# Altium schematic sheet LTC6803.SchDoc
size A
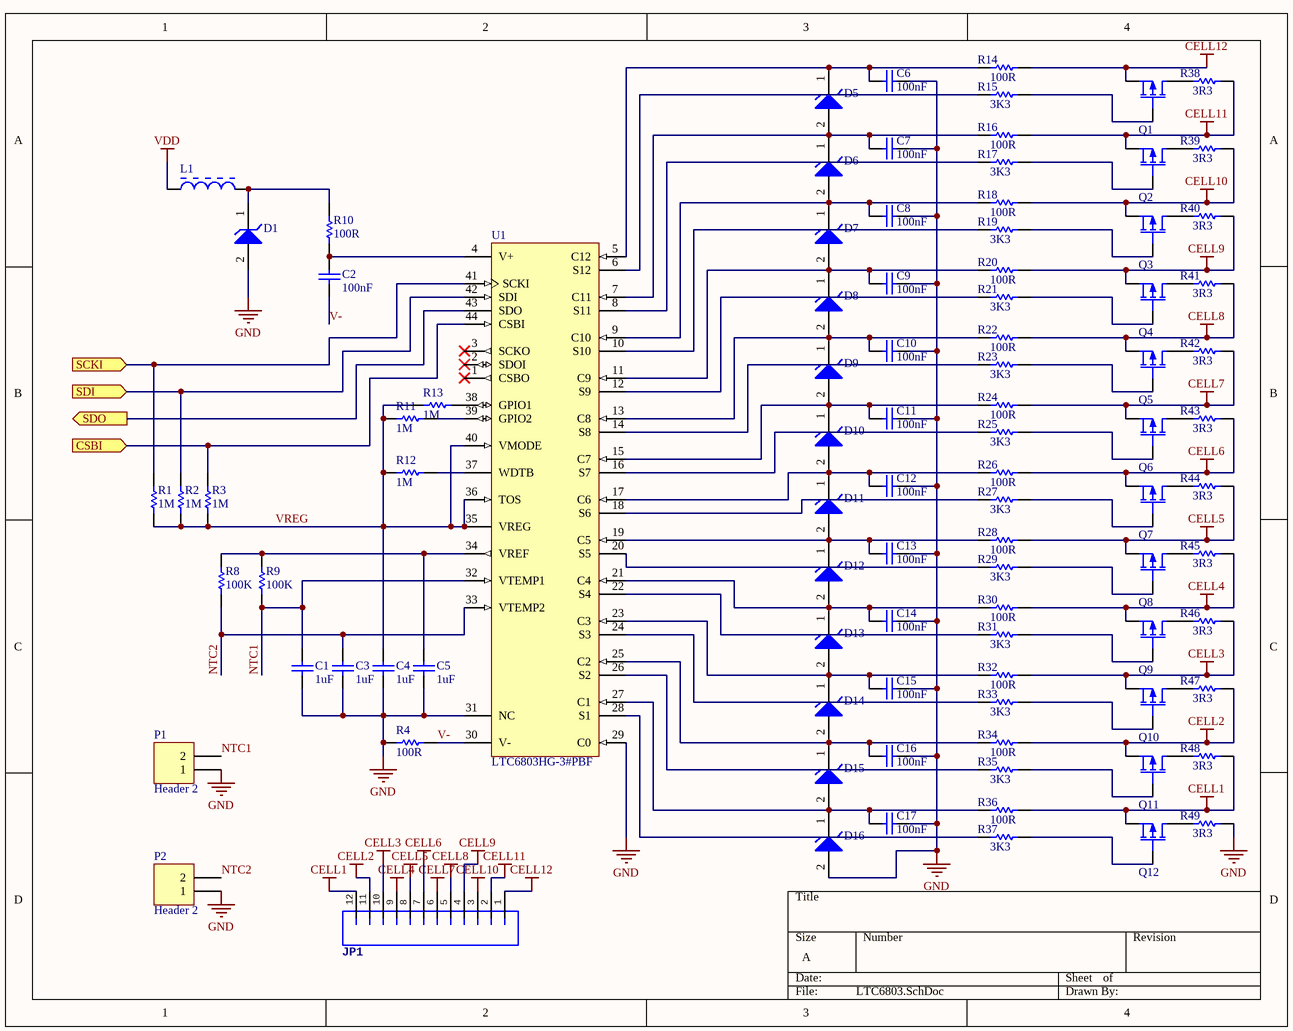
[diagram p0: LTC6803.SchDoc]

## Parts
C1  1uF  [CAPC0603(1608)100_N]
C2  100nF  [CAPC0603(1608)100_L]
C3  1uF  [CAPC0603(1608)100_N]
C4  1uF  [CAPC0603(1608)100_N]
C5  1uF  [CAPC0603(1608)100_N]
C6  100nF  [CAPC0603(1608)100_M]
C7  100nF  [CAPC0603(1608)100_M]
C8  100nF  [CAPC0603(1608)100_M]
C9  100nF  [CAPC0603(1608)100_M]
C10  100nF  [CAPC0603(1608)100_M]
C11  100nF  [CAPC0603(1608)100_M]
C12  100nF  [CAPC0603(1608)100_M]
C13  100nF  [CAPC0603(1608)100_M]
C14  100nF  [CAPC0603(1608)100_M]
C15  100nF  [CAPC0603(1608)100_M]
C16  100nF  [CAPC0603(1608)100_M]
C17  100nF  [CAPC0603(1608)100_M]
D1  (no value)  [SOD-123]
D5  (no value)  [ONSC-SOD-323-2-477-02_V]
D6  (no value)  [ONSC-SOD-323-2-477-02_V]
D7  (no value)  [ONSC-SOD-323-2-477-02_V]
D8  (no value)  [ONSC-SOD-323-2-477-02_V]
D9  (no value)  [ONSC-SOD-323-2-477-02_V]
D10  (no value)  [ONSC-SOD-323-2-477-02_V]
D11  (no value)  [ONSC-SOD-323-2-477-02_V]
D12  (no value)  [ONSC-SOD-323-2-477-02_V]
D13  (no value)  [ONSC-SOD-323-2-477-02_V]
D14  (no value)  [ONSC-SOD-323-2-477-02_V]
D15  (no value)  [ONSC-SOD-323-2-477-02_V]
D16  (no value)  [ONSC-SOD-323-2-477-02_V]
JP1  (no value)  [JST-6-PTH-VERT]
L1  (no value)  [MURA-BLM31-B60-CHIP-2_V3]
P1  Header 2  [HDR1X2]
P2  Header 2  [HDR1X2]
Q1  MOSFET-P  [SOT23-3]  (value not drawn)
Q2  MOSFET-P  [SOT23-3]  (value not drawn)
Q3  MOSFET-P  [SOT23-3]  (value not drawn)
Q4  MOSFET-P  [SOT23-3]  (value not drawn)
Q5  MOSFET-P  [SOT23-3]  (value not drawn)
Q6  MOSFET-P  [SOT23-3]  (value not drawn)
Q7  MOSFET-P  [SOT23-3]  (value not drawn)
Q8  MOSFET-P  [SOT23-3]  (value not drawn)
Q9  MOSFET-P  [SOT23-3]  (value not drawn)
Q10  MOSFET-P  [SOT23-3]  (value not drawn)
Q11  MOSFET-P  [SOT23-3]  (value not drawn)
Q12  MOSFET-P  [SOT23-3]  (value not drawn)
R1  1M  [RESC0603(1608)_L]
R2  1M  [RESC0603(1608)_L]
R3  1M  [RESC0603(1608)_L]
R4  100R  [RESC0603(1608)_L]
R8  100K  [RESC0603(1608)_N]
R9  100K  [RESC0603(1608)_N]
R10  100R  [RESC0603(1608)_L]
R11  1M  [RESC0603(1608)_L]
R12  1M  [RESC0603(1608)_L]
R13  1M  [RESC0603(1608)_L]
R14  100R  [RESC0603(1608)_N]
R15  3K3  [RESC0603(1608)_N]
R16  100R  [RESC0603(1608)_N]
R17  3K3  [RESC0603(1608)_N]
R18  100R  [RESC0603(1608)_N]
R19  3K3  [RESC0603(1608)_N]
R20  100R  [RESC0603(1608)_N]
R21  3K3  [RESC0603(1608)_N]
R22  100R  [RESC0603(1608)_N]
R23  3K3  [RESC0603(1608)_N]
R24  100R  [RESC0603(1608)_N]
R25  3K3  [RESC0603(1608)_N]
R26  100R  [RESC0603(1608)_N]
R27  3K3  [RESC0603(1608)_N]
R28  100R  [RESC0603(1608)_N]
R29  3K3  [RESC0603(1608)_N]
R30  100R  [RESC0603(1608)_N]
R31  3K3  [RESC0603(1608)_N]
R32  100R  [RESC0603(1608)_N]
R33  3K3  [RESC0603(1608)_N]
R34  100R  [RESC0603(1608)_N]
R35  3K3  [RESC0603(1608)_N]
R36  100R  [RESC0603(1608)_N]
R37  3K3  [RESC0603(1608)_N]
R38  3R3  [RESC2512(6432)_N]
R39  3R3  [RESC2512(6432)_N]
R40  3R3  [RESC2512(6432)_N]
R41  3R3  [RESC2512(6432)_N]
R42  3R3  [RESC2512(6432)_N]
R43  3R3  [RESC2512(6432)_N]
R44  3R3  [RESC2512(6432)_N]
R45  3R3  [RESC2512(6432)_N]
R46  3R3  [RESC2512(6432)_N]
R47  3R3  [RESC2512(6432)_N]
R48  3R3  [RESC2512(6432)_N]
R49  3R3  [RESC2512(6432)_N]
U1  LTC6803HG-3#PBF  [LT-G-44_L]

## Ports
CSBI (in), SCKI (in), SDI (in), SDO (out)

## Nets
CELL1: JP1.12 Q12.3(S) R36.2 R48.1
CELL2: JP1.11 Q11.3(S) R34.2 R47.1
CELL3: JP1.10 Q10.3(S) R32.2 R46.1
CELL4: JP1.9 Q9.3(S) R30.2 R45.1
CELL5: JP1.8 Q8.3(S) R28.2 R44.1
CELL6: JP1.7 Q7.3(S) R26.2 R43.1
CELL7: JP1.6 Q6.3(S) R24.2 R42.1
CELL8: JP1.5 Q5.3(S) R22.2 R41.1
CELL9: JP1.4 Q4.3(S) R20.2 R40.1
CELL10: JP1.3 Q3.3(S) R18.2 R39.1
CELL11: JP1.2 Q2.3(S) R16.2 R38.1
CELL12: JP1.1 Q1.3(S) R14.2
GND: C1.1 C3.1 C4.1 C5.1 C6.1 C7.1 C8.1 C9.1 C10.1 C11.1 C12.1 C13.1 C14.1 C15.1 C16.1 C17.1 D1.2(A) D16.2(A) P1.1 P2.1 R4.1 R49.1 U1.29(C0) U1.31(NC)
VDD: L1.1
CSBI: R3.2 U1.44(CSBI) ; port CSBI
NTC1: C1.2 P1.2 R9.1 U1.32(VTEMP1)
NTC2: C3.2 P2.2 R8.1 U1.33(VTEMP2)
SCKI: R1.2 U1.41(SCKI) ; port SCKI
SDI: R2.2 U1.42(SDI) ; port SDI
SDO: U1.43(SDO) ; port SDO
V-: C2.1 R4.2 U1.30(V-)
VREG: C4.2 R1.1 R2.1 R3.1 R11.1 R12.1 R13.1 U1.35(VREG) U1.36(TOS) U1.40(VMODE)
NetC2_2: C2.2 R10.1 U1.4(V+)
NetC5_2: C5.2 R8.2 R9.2 U1.34(VREF)
NetC6_2: C6.2 D5.1(K) R14.1 U1.5(C12)
NetC7_2: C7.2 D5.2(A) D6.1(K) R16.1 U1.7(C11)
NetC8_2: C8.2 D6.2(A) D7.1(K) R18.1 U1.9(C10)
NetC9_2: C9.2 D7.2(A) D8.1(K) R20.1 U1.11(C9)
NetC10_2: C10.2 D8.2(A) D9.1(K) R22.1 U1.13(C8)
NetC11_2: C11.2 D9.2(A) D10.1(K) R24.1 U1.15(C7)
NetC12_2: C12.2 D10.2(A) D11.1(K) R26.1 U1.17(C6)
NetC13_2: C13.2 D11.2(A) D12.1(K) R28.1 U1.19(C5)
NetC14_2: C14.2 D12.2(A) D13.1(K) R30.1 U1.21(C4)
NetC15_2: C15.2 D13.2(A) D14.1(K) R32.1 U1.23(C3)
NetC16_2: C16.2 D14.2(A) D15.1(K) R34.1 U1.25(C2)
NetC17_2: C17.2 D15.2(A) D16.1(K) R36.1 U1.27(C1)
NetD1_1: D1.1(K) L1.2 R10.2
NetQ1_1: Q1.1(G) R15.2
NetQ1_2: Q1.2(D) R38.2
NetQ2_1: Q2.1(G) R17.2
NetQ2_2: Q2.2(D) R39.2
NetQ3_1: Q3.1(G) R19.2
NetQ3_2: Q3.2(D) R40.2
NetQ4_1: Q4.1(G) R21.2
NetQ4_2: Q4.2(D) R41.2
NetQ5_1: Q5.1(G) R23.2
NetQ5_2: Q5.2(D) R42.2
NetQ6_1: Q6.1(G) R25.2
NetQ6_2: Q6.2(D) R43.2
NetQ7_1: Q7.1(G) R27.2
NetQ7_2: Q7.2(D) R44.2
NetQ8_1: Q8.1(G) R29.2
NetQ8_2: Q8.2(D) R45.2
NetQ9_1: Q9.1(G) R31.2
NetQ9_2: Q9.2(D) R46.2
NetQ10_1: Q10.1(G) R33.2
NetQ10_2: Q10.2(D) R47.2
NetQ11_1: Q11.1(G) R35.2
NetQ11_2: Q11.2(D) R48.2
NetQ12_1: Q12.1(G) R37.2
NetQ12_2: Q12.2(D) R49.2
NetR11_2: R11.2 U1.39(GPIO2)
NetR12_2: R12.2 U1.37(WDTB)
NetR13_2: R13.2 U1.38(GPIO1)
NetR15_1: R15.1 U1.6(S12)
NetR17_1: R17.1 U1.8(S11)
NetR19_1: R19.1 U1.10(S10)
NetR21_1: R21.1 U1.12(S9)
NetR23_1: R23.1 U1.14(S8)
NetR25_1: R25.1 U1.16(S7)
NetR27_1: R27.1 U1.18(S6)
NetR29_1: R29.1 U1.20(S5)
NetR31_1: R31.1 U1.22(S4)
NetR33_1: R33.1 U1.24(S3)
NetR35_1: R35.1 U1.26(S2)
NetR37_1: R37.1 U1.28(S1)

Not connected (* = marked no-connect by the designer): U1 1(CSBO)* 2(SDOI)* 3(SCKO)*

## Library data of the parts
C1 C3-C5 = CMP-1035-02730-1: CAP 1uF 6.3V Â±10% 0603 (1608 Metric) Thickness 1mm SMD; Case-EIA: 0603; Case-Metric: 1608; Rated Voltage: 6.3 V; Max Thickness: 1 mm; Technology: SMT; Tolerance: Â±10%; Value: 1uF
C2 = CMP-1035-02595-1: CAP 100nF 100V Â±10% 0603 (1608 Metric) Thickness 1mm SMD; Case-EIA: 0603; Case-Metric: 1608; Tolerance: Â±10%; Rated Voltage: 100 V; Value: 100nF; Technology: SMT; Max Thickness: 1 mm
C6-C17 = CMP-1035-02575-1: CAP 100nF 6.3V Â±5% 0603 (1608 Metric) Thickness 1mm SMD; Case-Metric: 1608; Case-EIA: 0603; Tolerance: Â±5%; Technology: SMT; Rated Voltage: 6.3 V; Max Thickness: 1 mm; Value: 100nF
D1 = CMHZ5265B
D5-D16 = CMP-1060-00726-1: Zener Voltage Regulator, 300 mW, 2-Pin SOD-323, Tape and Reel; Manufacturer: On Semiconductor; PartNumber: MM3Z12VT1; VZ Typ (V): 12; P Max (W): 0.3; Packing: Tape and Reel; ComponentLink3URL: http://www.onsemi.com/pub_link/Collateral/477-02.PDF.1; ComponentLink2Description: Datasheet; Mounting Technology: Surface Mount; PackageVersion: Rev. H, 03/2007; PackageDescription: 2-Pin SOD, Body 1.7 x 1.25 mm; ComponentLink1URL: http://www.onsemi.com/; ComponentLink1Description: Manufacturer URL; ComponentLink3Description: Package Specification; ComponentLink2URL: http://www.onsemi.cn/pub_link/Collateral/MM3Z2V4T1-D.PDF; DatasheetVersion: Rev. 9; PackageReference: SOD-323-2-477-02
JP1 = JST_12_RIGHT
L1 = MURA-FB-2
P1 P2 = Header 2: Header, 2-Pin; LatestRevisionDate: 17-Jul-2002; LatestRevisionNote: Re-released for DXP Platform.; Publisher: Altium Limited
Q1-Q12 = MOSFET-P: P-Channel MOSFET; Published: 8-Jun-2000; LatestRevisionDate: 17-Jul-2002; LatestRevisionNote: Re-released for DXP Platform.; PackageVersion: 1995/1996; PackageReference: E3; Publisher: Altium Limited; PackageDescription: TO, Flat Index; 3 In-Line, Axial Leads; Body Dia. 4.6mm; Lead Dia. 0.5 mm (max)
R1-R3 R11-R13 = CMP-1012-00849-1: 1M 0.1W 1% 0603 (1608 Metric)  SMD; Value: 1000000.00 Ohm; Case-EIA: 0603; Case-Metric: 1608; Power: 0.1 W; Tolerance: 1 %; Technology: SMT
R4 R10 R14 R16 R18 R20 R22 R24 R26 R28 R30 R32 R34 R36 = CMP-1012-00050-1: 100R 0.1W 5% 0603 (1608 Metric)  SMD; Case-EIA: 0603; Value: 100.00 Ohm; Case-Metric: 1608; Tolerance: 5 %; Technology: SMT; Power: 0.1 W
R8 R9 = CMP-1012-00122-1: 100K 0.1W 5% 0603 (1608 Metric)  SMD; Case-EIA: 0603; Value: 100000.00 Ohm; Case-Metric: 1608; Tolerance: 5 %; Power: 0.1 W; Technology: SMT
R15 R17 R19 R21 R23 R25 R27 R29 R31 R33 R35 R37 = CMP-1012-00086-1: 3K3 0.1W 5% 0603 (1608 Metric)  SMD; Case-EIA: 0603; Value: 3300.00 Ohm; Case-Metric: 1608; Technology: SMT; Tolerance: 5 %; Power: 0.1 W
R38-R49 = CMP-1018-00014-1: 3R3 1W 5% 2512 (6432 Metric)  SMD; Value: 3.30 Ohm; Case-EIA: 2512; Case-Metric: 6432; Tolerance: 5 %; Technology: SMT; Power: 1 W
U1 = CMP-0471-00238-1: Multicell Battery Stack Monitor, 60 V Vin MAX, 44-pin SOP (G-44), -40 to 125 degC, Pb-Free; Manufacturer: Linear Technology; Number of Cells: > 1000 V of stacked Li-Ion cells; Vin Max(V): 60; Battery Chemistry: Li-Ion, Supercapacitors, Multi-Chemistry; ComponentLink2URL: http://cds.linear.com/docs/en/datasheet/680313fa.pdf; ComponentLink1URL: http://www.linear.com/; PackageReference: G-44; DatasheetVersion: Rev. A; RoHS: TRUE; Mounting Technology: Surface Mount; ComponentLink3Description: Package Specification; PartNumber: LTC6803HG-3#PBF; Type of Charger: Battery Stack Monitor; PackageVersion: Rev. Ã˜, 06/2010; ComponentLink1Description: Manufacturer URL; PackageDescription: 44-Pin Plastic SSOP, Body 12.8 x 5.3 mm, Pitch 0.5 mm; ComponentLink3URL: http://cds.linear.com/docs/en/packaging/SSOP_44_05-08-1754.pdf; ComponentLink2Description: Datasheet